# Altium schematic sheet Sensors.SchDoc: FER_TEMPLATE
size A4; Author: Leon Baždar; CompanyName: FER; Address1: Zagreb
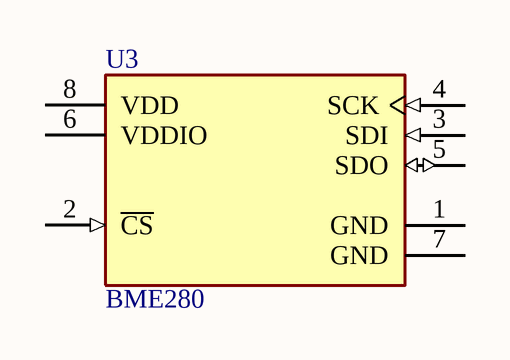
[diagram p0: Sensors.SchDoc]

## Parts
U3  BME280  [FP-BME280-MFG]

## Nets

Not connected (* = marked no-connect by the designer): U3 1(GND) 2(~{CS}) 3(SDI) 4(SCK) 5(SDO) 6(VDDIO) 7(GND) 8(VDD)

## Notes on the sheet
- Project:
- File:
- Size:
- A4
- Author:
- Revision:
- Date:
- Sheet
- of

## Library data of the parts
U3 = CMP-191074-000001-1: SENSOR PRESSURE HUMIDITY TEMP; Output Type: SPI; Sensor Type: Temperature; Response Time: 1s; Accuracy: 3%; Packaging: Cut Tape; Lead Free: Lead Free; Number of Pins: 8; Min Operating Temperature: -40°C; Max Operating Temperature: 85°C; Mount: Surface Mount; Case/Package: LGA